# EAGLE design lcd_driver (EAGLE 5.10)
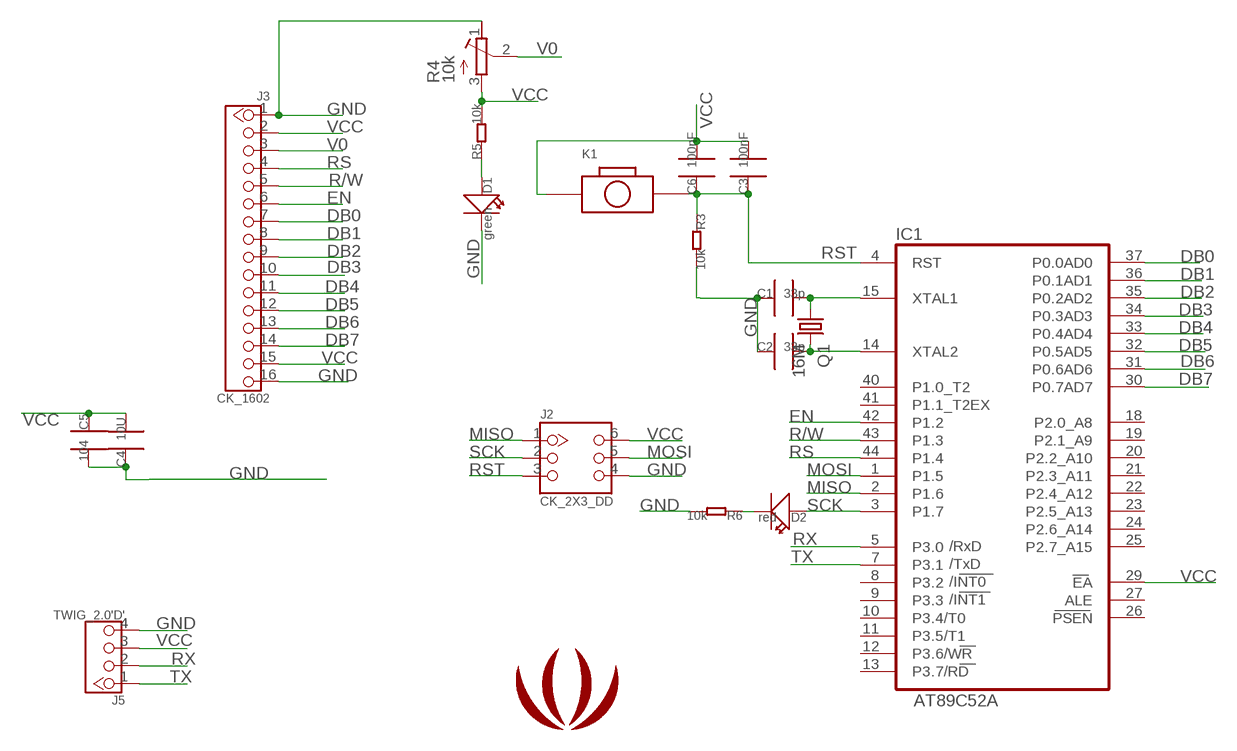
[diagram p0: schematic, sheet 1]

## Parts
C1  33p  006-C0603  [0603]
C2  33p  006-C0603  [0603]
C3  100nF  006-C0603  [0603]
C4  10U  006-C0805  [0805]
C5  104  006-C0603  [0603]
C6  100nF  006-C0603  [0603]
D1  green  LED0603_DD  [LED0603]
D2  red  LED0603_DD  [LED0603]
IC1  AT89C52A  [TQFP44]
J2  CK_2X3_DD  [CK_2X3]
J3  CK_1602  [CK_1602]
J5  TWIG_2.0'D'  [2.0_1X4_90]
K1  BOTTON_1_DP  [BTN_5.0_RST]
LOGO1  LOGO_COPPER200X166  [LOGO_COPPER]
Q1  16M  CRYSTALSMD  [HC49UP]
R3  10k  005-R0603  [0603]
R4  10k  R-TRIMM3362  [RTRIM3362]
R5  10k  005-R0603  [0603]
R6  10k  005-R0603  [0603]

## Nets
DB0: IC1.37(P0.0AD0) J3.7
DB1: IC1.36(P0.1AD1) J3.8
DB2: IC1.35(P0.2AD2) J3.9
DB3: IC1.34(P0.3AD3) J3.10
DB4: IC1.33(P0.4AD4) J3.11
DB5: IC1.32(P0.5AD5) J3.12
DB6: IC1.31(P0.6AD6) J3.13
DB7: IC1.30(P0.7AD7) J3.14
EN: IC1.42(P1.2) J3.6
GND: C1.1 C2.1 C4.1 C5.2 D1.2(-) J2.4 J3.1 J3.16 J5.4 R3.2 R4.1(A) R6.2
MISO: IC1.2(P1.6) J2.1
MOSI: IC1.1(P1.5) J2.5
N$1: C2.2 IC1.14(XTAL2) Q1.2
N$2: C1.2 IC1.15(XTAL1) Q1.1
N$4: D1.1(+) R5.1
N$6: D2.2(-) R6.1
R/W: IC1.43(P1.3) J3.5
RS: IC1.44(P1.4) J3.4
RST: C3.1 C6.1 IC1.4(RST) J2.3 K1.P$2 R3.1
RX: IC1.5(P3.0) J5.2
SCK: D2.1(+) IC1.3(P1.7) J2.2
TX: IC1.7(P3.1) J5.1
V0: J3.3 R4.2(S)
VCC: C3.2 C4.2 C5.1 C6.2 IC1.29(EA) J2.6 J3.2 J3.15 J5.3 K1.P$1 R4.3(E) R5.2
Unconnected: IC1.8(P3.2) IC1.9(P3.3) IC1.10(P3.4/T0) IC1.11(P3.5/T1) IC1.12(P3.6/WR) IC1.13(P3.7/RD) IC1.18(P2.0_A8) IC1.19(P2.1_A9) IC1.20(P2.2_A10) IC1.21(P2.3_A11) IC1.22(P2.4_A12) IC1.23(P2.5_A13) IC1.24(P2.6_A14) IC1.25(P2.7_A15) IC1.26(PSEN) IC1.27(ALE) IC1.40(P1.0_T2) IC1.41(P1.1_T2EX)

## Power pins joined to a net without a drawn wire
GND: IC1.16(GND)
VCC: IC1.38(VCC)

## Library data of the parts
C1-C6 = Discrete:006-C*: Ceramic Capacitors
D1 D2 = CPT_SMD:LED0603
IC1 = atmel:AT89C*52: MICROCONTROLLER 8 Kbytes FLASH; 2K Bytes EEPROM Compatible with MCS-51 Products at89s8252.pdf
J2 = CONNECTER:CK_2X3
J3 = CONNECTER:CK_1602
J5 = CONNECTER:TWIG_2.0
K1 = CPT_SMD:BOTTON_1
LOGO1 = logo:LOGO_COPPER
Q1 = SparkFun:CRYSTAL: Crystals Various standard crystals. Proven footprints. Spark Fun Electronics SKU : COM-00534
R3 R5 R6 = Discrete:005-R*
R4 = rcl:R-TRIMM: Trimm resistor

## Board
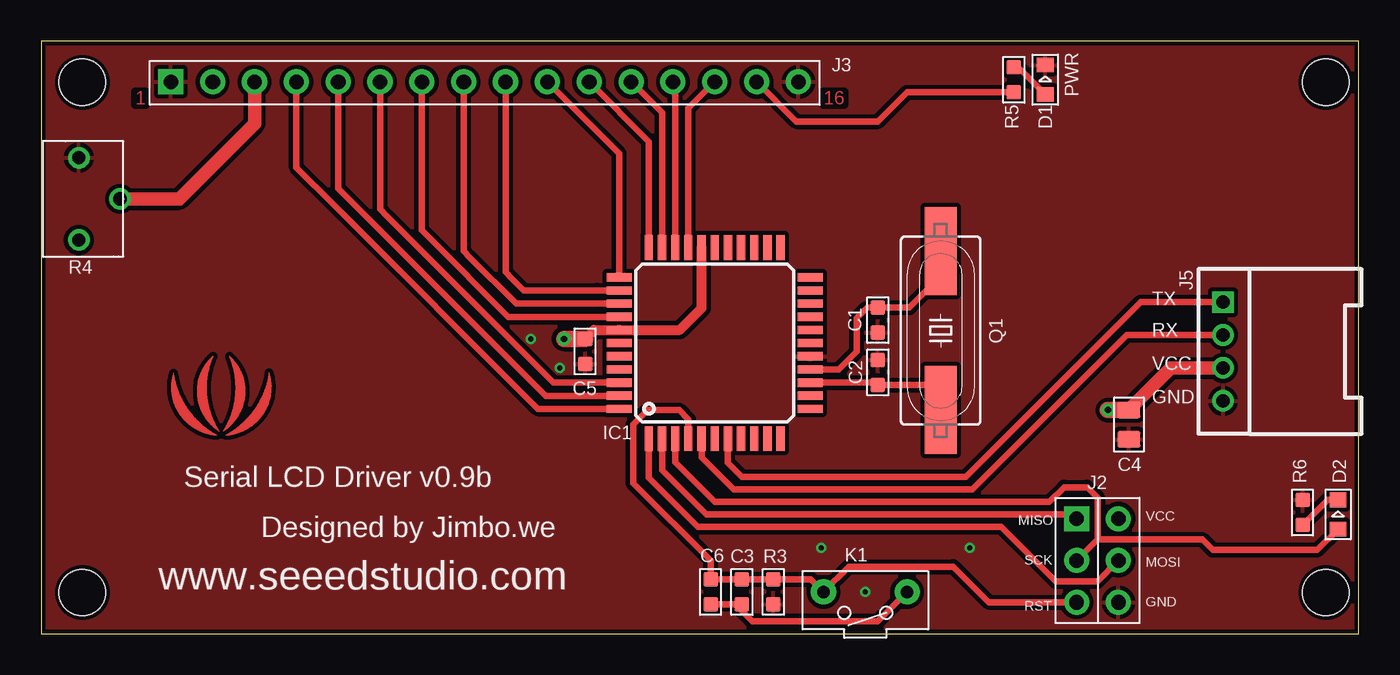
[diagram p1: board, top side]
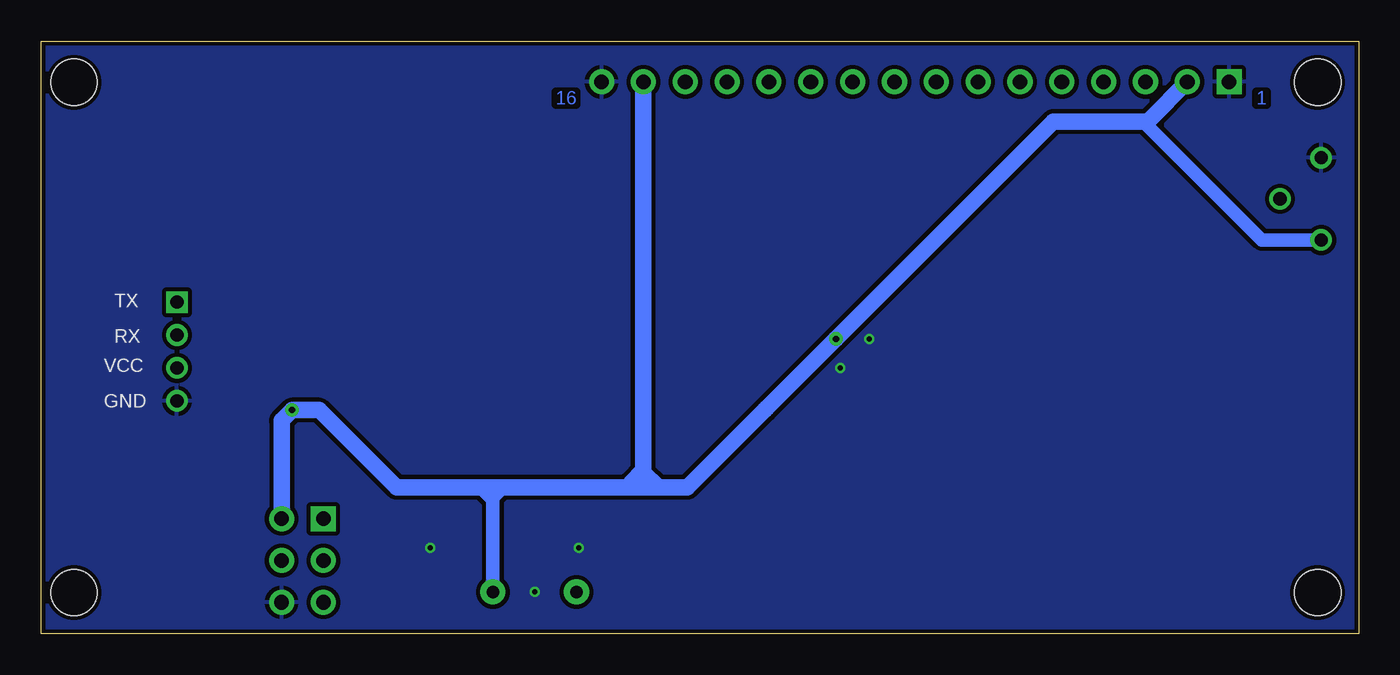
[diagram p2: board, bottom side, seen from below]

Size 80 x 36 mm. Coordinates in mm from the lower left corner, seen from the top.
Outline: 80,36 0,36 0,0 80,0 80,36
Copper layers (1*16): Top 0.035mm / dielectric 1.5mm / Bottom 0.035mm
Design rules "SeeedStudio_rule_no_angle_090911": minimum track width 6mil, minimum drill 12mil, track to track 6mil, track to pad 6mil, pad to pad 6mil, via to via 6mil, smd to smd 0mil, copper to edge 10mil, drill to drill 10mil, minimum pad ring 10mil, minimum via ring 6mil, stop-mask expansion 2mil, vias tented up to drill 100mil, thermal gap 10mil
Holes 2.8 mm at 78,33.5 78,2.5 2.5,2.5 2.5,33.5
vRestrict: area 12,24.5 to 16.4,27.9; area 12,7.2 to 16.4,10.6; area 38.5,7.3 to 42.9,10.7; area 38.5,24.6 to 42.9,28; area 68,7.3 to 72.4,10.7; area 68,24.6 to 72.4,28

### Footprints (pad centres in the part's own frame; a part is rotated, then mirrored left to right if it is on the bottom)
0603 = smd 0.889 x 0.889: 1 -0.762,0; 2 0.762,0
0805 = smd 1.016 x 1.397: 1 -0.889,0; 2 0.889,0
LED0603 = smd 0.889 x 1.016: 1 -0.889,0; 2 0.889,0
TQFP44@1 = smd 1.5 x 0.5: 1 -5.8,4; 2 -5.8,3.2; 3 -5.8,2.4; 4 -5.8,1.6; 5 -5.8,0.8; 6 -5.8,0; 7 -5.8,-0.8; 8 -5.8,-1.6; 9 -5.8,-2.4; 10 -5.8,-3.2; 11 -5.8,-4; 23 5.8,-4; 24 5.8,-3.2; 25 5.8,-2.4; 26 5.8,-1.6; 27 5.8,-0.8; 28 5.8,0; 29 5.8,0.8; 30 5.8,1.6; 31 5.8,2.4; 32 5.8,3.2; 33 5.8,4 | smd 0.5 x 1.5: 12 -4,-5.8; 13 -3.2,-5.8; 14 -2.4,-5.8; 15 -1.6,-5.8; 16 -0.8,-5.8; 17 0,-5.8; 18 0.8,-5.8; 19 1.6,-5.8; 20 2.4,-5.8; 21 3.2,-5.8; 22 4,-5.8; 34 4,5.8; 35 3.2,5.8; 36 2.4,5.8; 37 1.6,5.8; 38 0.8,5.8; 39 0,5.8; 40 -0.8,5.8; 41 -1.6,5.8; 42 -2.4,5.8; 43 -3.2,5.8; 44 -4,5.8
CK_2X3 = drill 0.889 pad 1.524 square: 1 -1.27,2.54 | drill 0.889 pad 1.524 round: 2 -1.27,0; 3 -1.27,-2.54; 4 1.27,-2.54; 5 1.27,0; 6 1.27,2.54
CK_1602 = drill 0.889 pad 1.524 square: 1 0,19.05 | drill 0.889 pad 1.524 round: 2 0,16.51; 3 0,13.97; 4 0,11.43; 5 0,8.89; 6 0,6.35; 7 0,3.81; 8 0,1.27; 9 0,-1.27; 10 0,-3.81; 11 0,-6.35; 12 0,-8.89; 13 0,-11.43; 14 0,-13.97; 15 0,-16.51; 16 0,-19.05
2.0_1X4_90 = drill 0.8 pad 1.27 square: 1 -3,0 | drill 0.8 pad 1.27 round: 2 -1,0; 3 1,0; 4 3,0
BTN_5.0_RST = drill 0.762 pad 1.524 round: P$1 0,2.54; P$2 0,-2.54
HC49UP = smd 5.334 x 1.93: 1 -4.826,0; 2 4.826,0
RTRIM3362 = drill 0.8 round: 1 -2.5,0; 2 0,2.5; 3 2.5,0

### Placement (x,y rotation side)
C1  50.8,19.05 90 top
C2  50.8,15.88 270 top
C3  42.55,2.54 270 top
C4  66.04,12.7 90 top
C5  33.02,17.14 270 top
C6  40.64,2.54 270 top
D1  60.96,33.66 90 top
D2  78.74,7.24 90 top
IC1  AT89C52A  [TQFP44@1]  40.89,17.65 90 top
J2  64.14,4.45 0 top
J3  26.92,33.53 90 top
J5  71.75,17.14 270 top
K1  50.04,2.54 270 top
LOGO1  10.92,13.72 0 top
Q1  54.61,18.41 270 top
R3  44.45,2.54 270 top
R4  2.29,26.42 270 top
R5  59.05,33.66 270 top
R6  76.58,7.37 90 top

### Tracks (layer width: path | path; a pad name or v marks a point on that pad's centre or on a via)
DB0
  Top 0.406: IC1.37 32.82,19.25 28.37,19.25 23.5,24.13 23.11,24.51 J3.7
DB1
  Top 0.406: IC1.36 33.29,20.05 28.84,20.05 26.04,22.86 25.65,23.24 J3.8
DB2
  Top 0.406: IC1.35 33.76,20.85 29.31,20.85 28.57,21.59 28.19,21.97 J3.9
DB3
  Top 0.406: IC1.34 35.09,29.17 J3.10
DB4
  Top 0.406: IC1.33 36.89,29.91 J3.11
DB5
  Top 0.406: IC1.32 37.69,31.65 J3.12
DB6
  Top 0.406: IC1.31 38.49,33.39 J3.13
DB7
  Top 0.406: IC1.30 39.29,31.93 J3.14
EN
  Top 0.406: IC1.42 31.1,15.25 20.95,25.4 20.57,25.78 J3.6
GND  (via drill 0.3)
  other vias: 56.39,5.21 47.37,5.21 50.04,2.54 29.72,17.91 31.5,16.13
  pour Top: -4.45,36.2 -3.17,36.2 -3.17,34.92 -4.45,34.92
  pour Bottom (isolate 0.254): -0.25,-0.25 80.14,-0.25 80.14,36.2 -0.25,36.2
  pour Top (isolate 0.254): -0.25,-0.25 -0.25,36.2 80.14,36.2 80.14,-0.25
MISO
  Top 0.406: IC1.2 37.69,9.93 40.01,7.62 40.39,7.24 62.61,7.24 J2.1
MOSI
  Top 0.406: IC1.1 36.89,9.46 39.37,6.99 39.75,6.6 39.88,6.48 58.29,6.48 61.59,3.17 64.14,3.17 J2.5
N$1
  Top 0.406: IC1.14 50.66,15.25 C2.2 54.1,15.11 54.61,14.61 Q1.2
N$2
  Top 0.406: IC1.15 48.44,16.05 49.53,17.14 49.53,19.18 50.16,19.81 C1.2 52.7,19.81 54.61,21.72 Q1.1
N$4
  Top 0.406: R5.1 59.31,34.42 D1.1
N$6
  Top 0.406: D2.2 78.11,8.13 R6.1
R/W
  Top 0.406: IC1.43 30.63,14.45 19.05,26.04 18.03,27.05 J3.5
RS
  Top 0.406: IC1.44 30.16,13.65 17.78,26.04 15.49,28.32 J3.4
RST
  Top 0.406: IC1.4 39.29,13.03 38.73,13.59 36.83,13.59 35.94,12.7 35.94,9.14 40.64,4.45 C6.1 C3.1 R3.1 46.74,3.3 K1.P$2 49.02,4.06 55.37,4.06 57.53,1.91 J2.3
RX
  Top 0.406: IC1.5 40.09,10.71 42.04,8.76 56.52,8.76 65.9,18.14 J5.2
SCK
  Top 0.406: IC1.3 38.49,10.4 40.64,8.26 40.77,8.13 40.89,8 59.31,8 61.21,8 62.1,8.89 63.5,8.89 64.14,8.26 64.14,5.71 | 64.14,5.71 J2.2 | 64.14,5.71 70.48,5.71 71.12,5.08 74.3,5.08 77.47,5.08 D2.1
TX
  Top 0.406: IC1.7 41.69,10.38 42.55,9.53 56.13,9.53 66.67,20.07 66.75,20.14 J5.1
V0
  Top 0.813: R4.2 8.38,26.42 12.95,30.99 J3.3
VCC  (via drill 0.38 pad 0.81)
  Top 0.406: 42.42,1.78 C6.2 | 42.42,1.78 C3.2 | R5.2 52.58,32.89 50.8,31.11 45.85,31.11 J3.15 | 42.42,1.78 42.42,1.52 43.18,0.76 50.8,0.76 K1.P$1
  Top 0.61: C5.1 33.57,18.45 IC1.38 38.77,18.45 39.37,19.05 40.09,19.77 IC1.29
  Top 0.813: J5.3 68.6,16.14 C4.2
  Top 1.016: v64.77,13.59 C4.2 | v31.75,17.91 C5.1
  Bottom 0.813: K1.P$1 52.58,8.13 52.7,8.26 53.09,8.64 52.58,8.26 51.94,8.89 51.82,8.89 | R4.3 5.88,23.92 13.08,31.11
  Bottom 1.016: 35.94,13.72 v31.75,17.91 18.54,31.11 13.08,31.11 12.83,31.11 12.7,31.24 J3.2 | 35.94,13.72 36.07,13.59 | 43.43,9.91 J3.15 | 43.43,9.91 44.2,9.14 | J2.6 65.41,12.95 v64.77,13.59 63.12,13.59 58.42,8.89 51.82,8.89 42.55,8.89 | 42.55,8.89 41.27,8.89 40.77,8.89 35.94,13.72 | 43.43,9.91 43.43,9.78 42.55,8.89

### Text on the board
Top: 1 | 16
Bottom: 1 | 16
tPlace: PWR | TX | RX | VCC | GND | Serial LCD Driver v0.9b | MISO | VCC | Designed by Jimbo.we | SCK | MOSI | www.seeedstudio.com | GND | RST
bPlace: TX | RX | VCC | GND